# Altium schematic sheet HIVE_BOARD_BLOCK_DIAG.SchDoc
size Tabloid; SheetNumber: 2; SheetTotal: 12; Sheet_Name: Block diagram; Size: 11x17
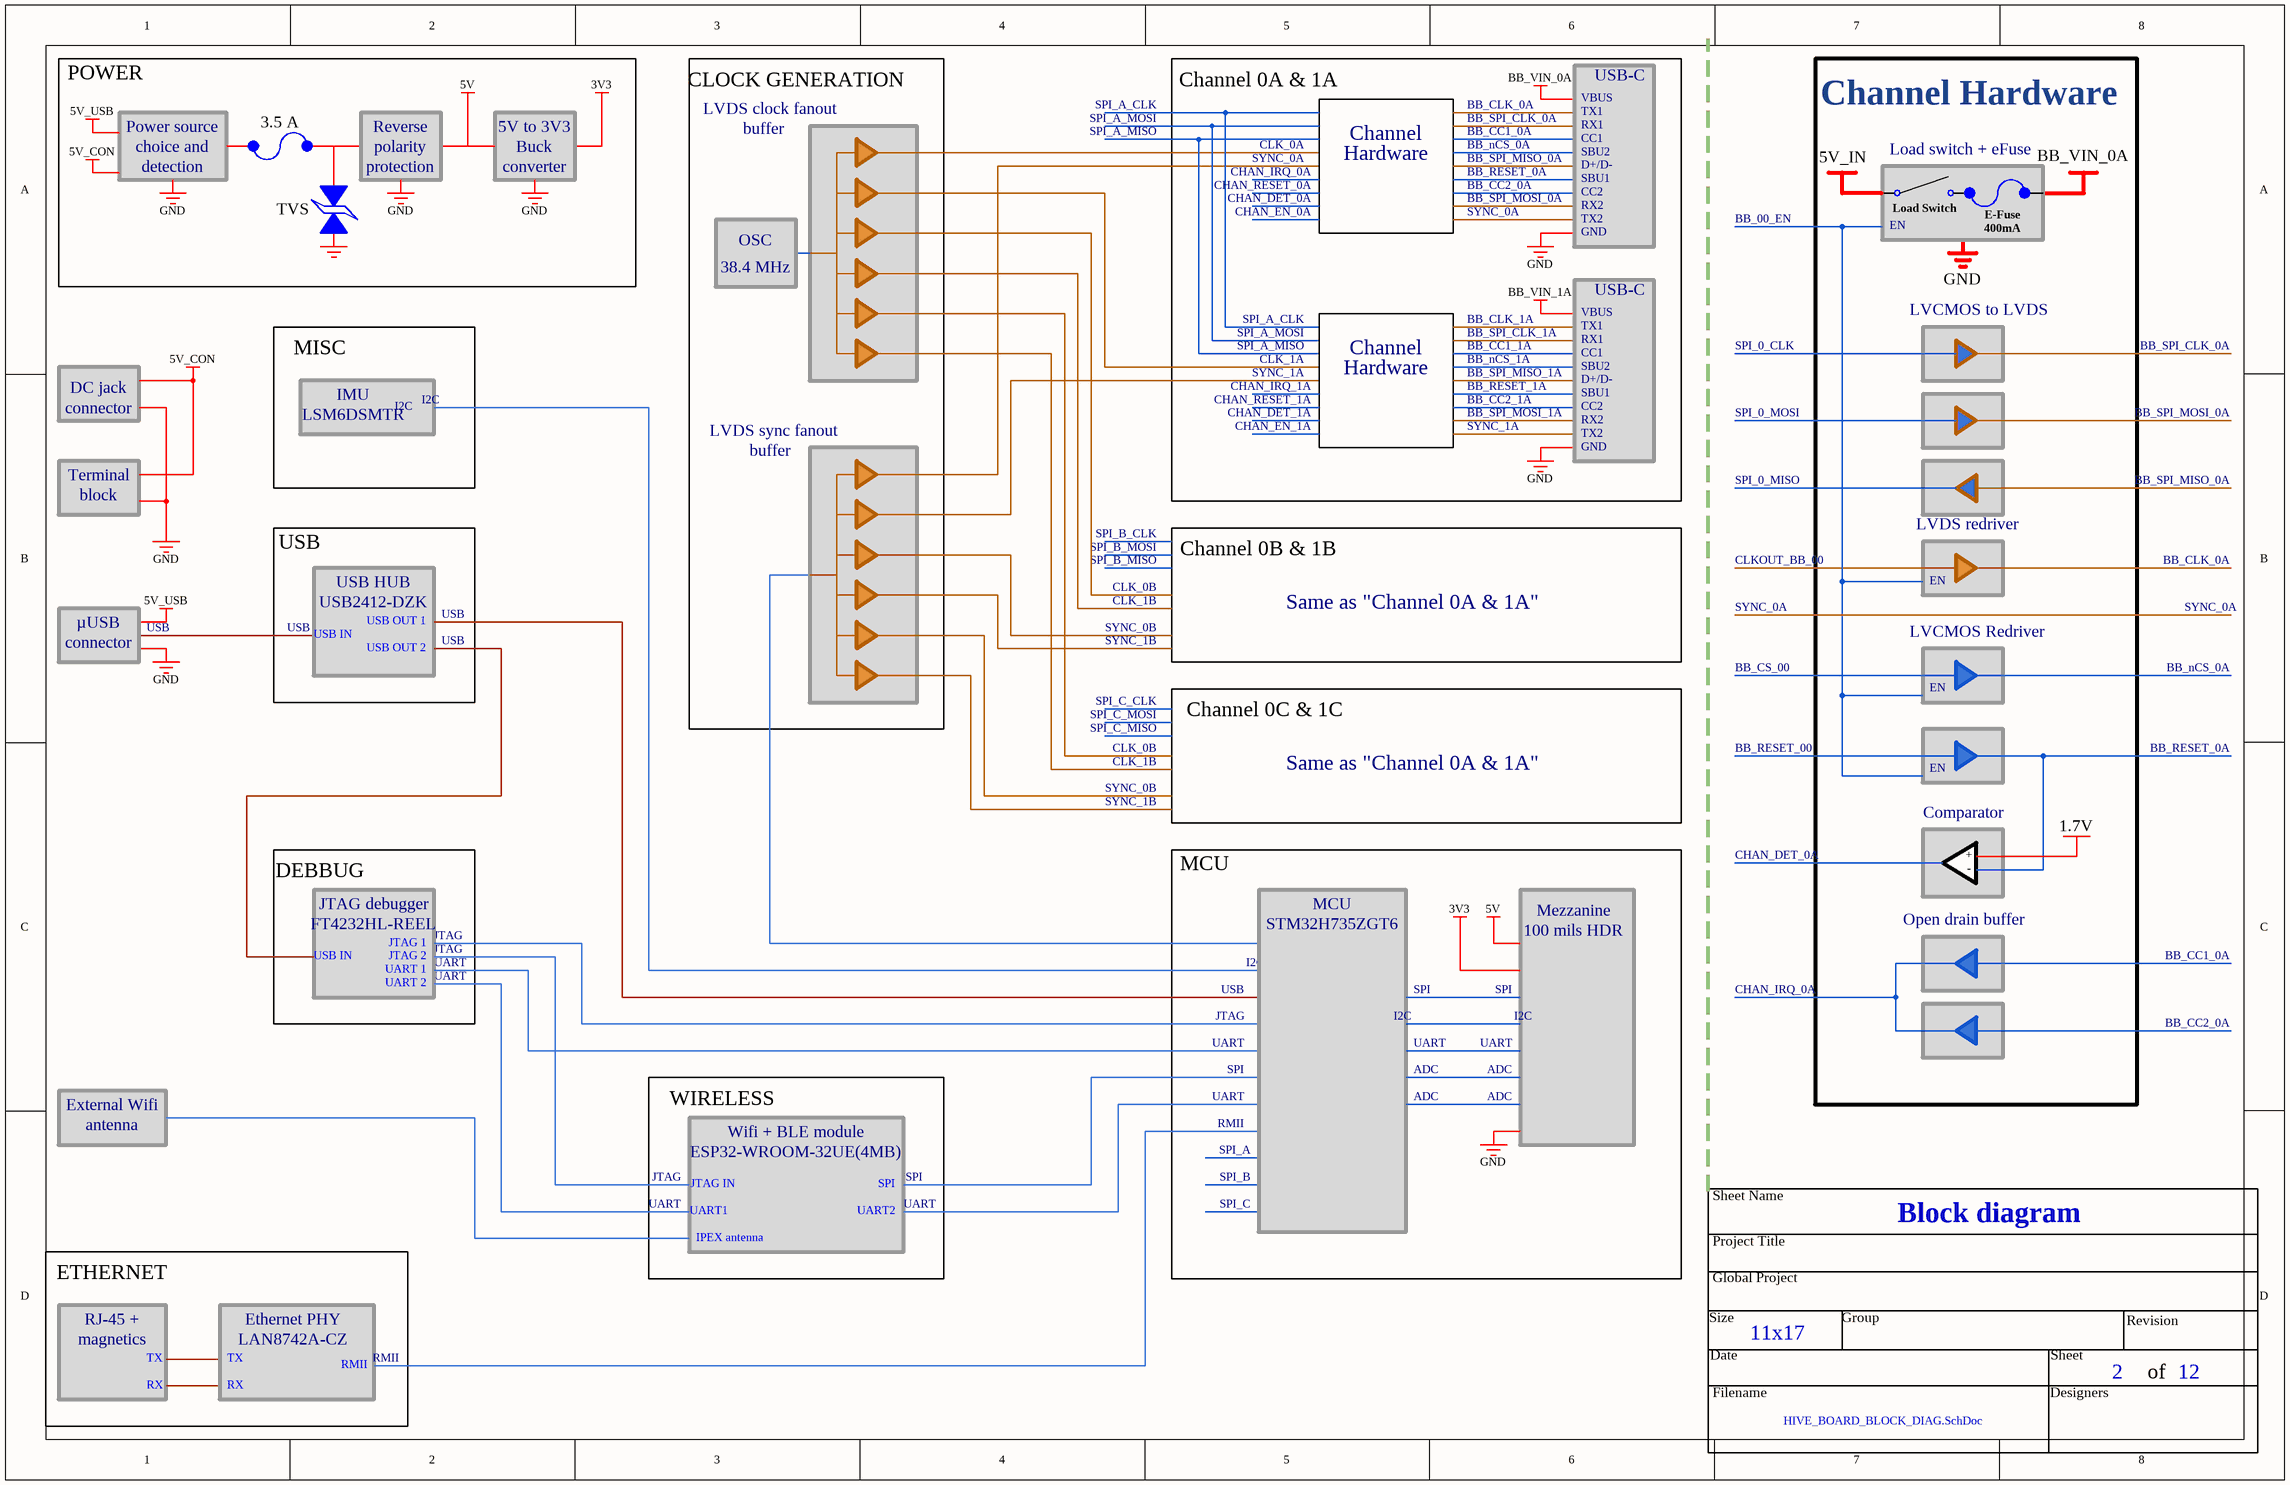
[diagram p0: HIVE_BOARD_BLOCK_DIAG.SchDoc]

## Notes on the sheet
- POWER
- 5V
- 3V3
- CLOCK GENERATION
- Channel 0A & 1A
- BB_VIN_0A
- USB-C
- Channel Hardware
- 5V_USB
- 5V_CON
- Power source
- choice and
- detection
- 3.5 A
- Reverse
- polarity
- protection
- 5V to 3V3
- Buck
- converter
- LVDS clock fanout
- buffer
- SPI_A_CLK
- SPI_A_MOSI
- SPI_A_MISO
- CLK_0A
- SYNC_0A
- Channel
- Hardware
- BB_SPI_MISO_0A
- BB_CLK_0A
- BB_SPI_CLK_0A
- BB_nCS_0A
- BB_CC1_0A
- TX1
- RX1
- CC1
- SBU2
- VBUS
- D+/D-
- 5V_IN
- Load switch + eFuse
- GND
- TVS
- CHAN_IRQ_0A
- CHAN_RESET_0A
- CHAN_DET_0A
- CHAN_EN_0A
- BB_SPI_MOSI_0A
- BB_RESET_0A
- BB_CC2_0A
- SBU1
- CC2
- RX2
- TX2
- BB_00_EN
- Load Switch
- EN
- OSC
- 38.4 MHz
- BB_VIN_1A
- E-Fuse
  400mA
- MISC
- CLK_1A
- BB_CLK_1A
- BB_SPI_CLK_1A
- BB_nCS_1A
- BB_CC1_1A
- SPI_0_CLK
- LVCMOS to LVDS
- DC jack
- connector
- IMU
- LSM6DSMTR
- I2C
- LVDS sync fanout
- SYNC_1A
- CHAN_IRQ_1A
- CHAN_RESET_1A
- CHAN_DET_1A
- CHAN_EN_1A
- BB_SPI_MISO_1A
- BB_SPI_MOSI_1A
- BB_RESET_1A
- BB_CC2_1A
- SPI_0_MOSI
- Terminal
- block
- SPI_0_MISO
- USB
- SPI_B_CLK
- SPI_B_MOSI
- SPI_B_MISO
- Channel 0B & 1B
- CLKOUT_BB_00
- LVDS redriver
- µUSB
- USB HUB
- USB2412-DZK
- USB OUT 1
- CLK_0B
- SYNC_0B
- CLK_1B
- Same as "Channel 0A & 1A"
- USB IN
- USB OUT 2
- SPI_C_CLK
- SYNC_1B
- Channel 0C & 1C
- BB_CS_00
- LVCMOS Redriver
- SPI_C_MOSI
- SPI_C_MISO
- BB_RESET_00
- Comparator
- 1.7V
- DEBBUG
- JTAG debugger
- MCU
- +
- -
- FT4232HL-REEL
- JTAG 1
- JTAG 2
- UART 1
- JTAG
- UART
- STM32H735ZGT6
- Mezzanine
- 100 mils HDR
- Open drain buffer
- UART 2
- SPI
- External Wifi
- WIRELESS
- ADC
- antenna
- Wifi + BLE module
- ESP32-WROOM-32UE(4MB)
- RMII
- SPI_A
- IPEX antenna
- UART1
- JTAG IN
- UART2
- SPI_B
- SPI_C
- ETHERNET
- RJ-45 +
- magnetics
- TX
- Ethernet PHY
- LAN8742A-CZ
- RX
- Sheet Name
- Project Title
- Global Project
- Revision
- Size
- Date
- Group
- Sheet
- of
- Filename
- Designers